# EAGLE design dualPilot (EAGLE 9.3.1)
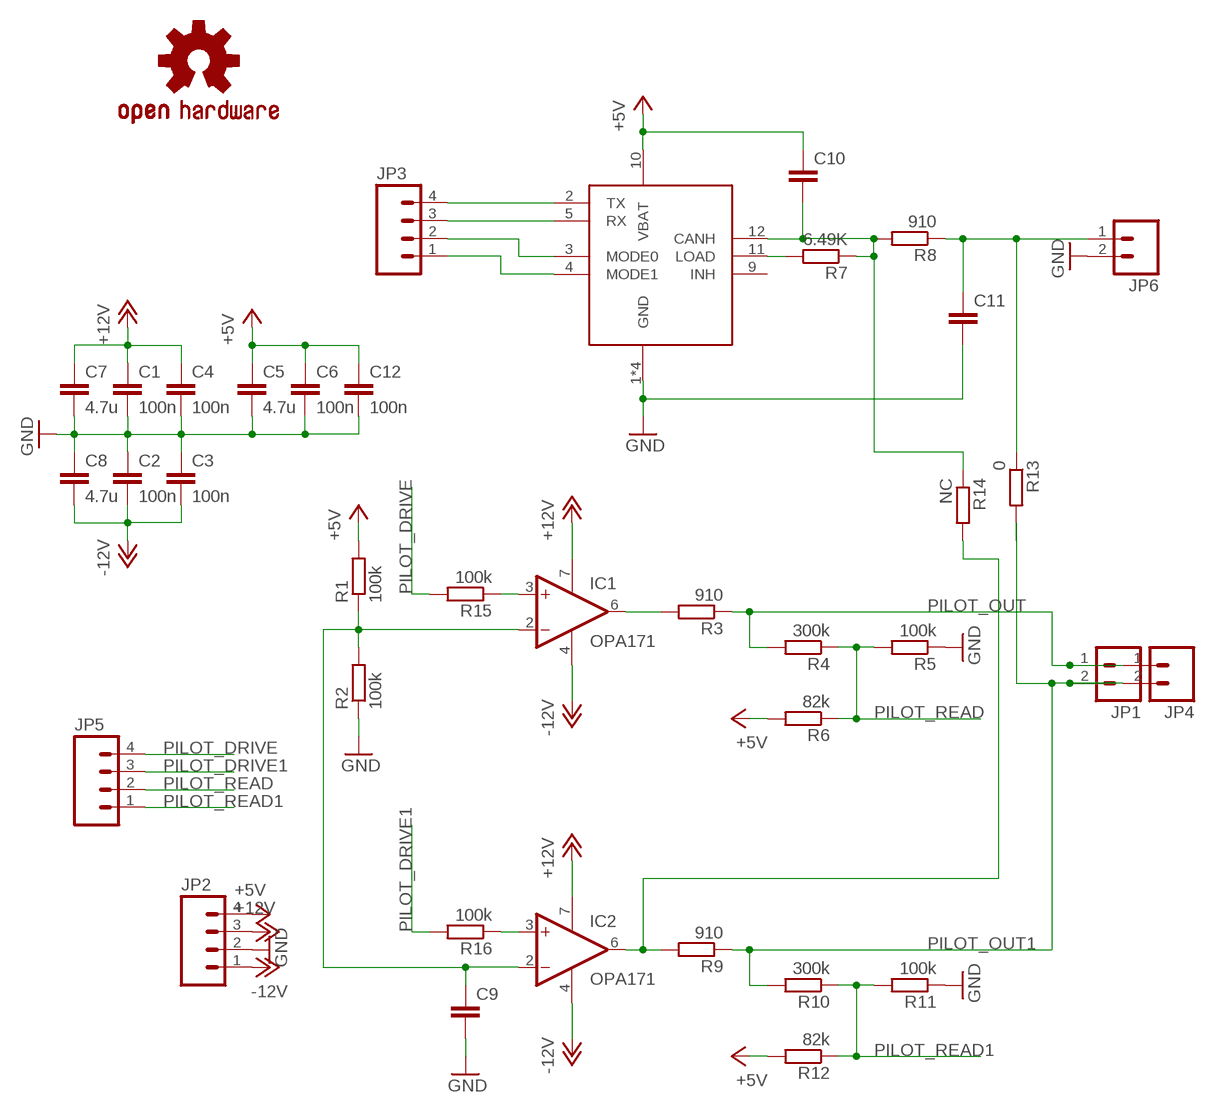
[diagram p0: schematic, sheet 1]

## Parts
C1  100n  CAP0805  [0805]
C2  100n  CAP0805  [0805]
C3  100n  CAP0805  [0805]
C4  100n  CAP0805  [0805]
C5  4.7u  CAP0805  [0805]
C6  100n  CAP0805  [0805]
C7  4.7u  CAP0805  [0805]
C8  4.7u  CAP0805  [0805]
C9  CAP0805  [0805]
C10  CAP0805  [0805]
C11  CAP0805  [0805]
C12  100n  CAP0805  [0805]
IC1  OPA171  OPA344U  [SO08]
IC2  OPA171  OPA344U  [SO08]
JP1  M02LOCK_LONGPADS  [1X02_LOCK_LONGPADS]
JP2  M04LONGPADS  [1X04_LONGPADS]
JP3  M04LONGPADS  [1X04_LONGPADS]
JP4  M025MM  [SCREWTERMINAL-5MM-2]
JP5  M04LONGPADS  [1X04_LONGPADS]
JP6  M02LOCK_LONGPADS  [1X02_LOCK_LONGPADS]
R1  100k  R-EU_R0805  [R0805]
R2  100k  R-EU_R0805  [R0805]
R3  910  R-EU_R1206  [R1206]
R4  300k  R-EU_R0805  [R0805]
R5  100k  R-EU_R0805  [R0805]
R6  82k  R-EU_R0805  [R0805]
R7  6.49K  R-EU_R0805  [R0805]
R8  910  R-EU_R1206  [R1206]
R9  910  R-EU_R1206  [R1206]
R10  300k  R-EU_R0805  [R0805]
R11  100k  R-EU_R0805  [R0805]
R12  82k  R-EU_R0805  [R0805]
R13  0  R-EU_R0805  [R0805]
R14  NC  R-EU_R0805  [R0805]
R15  100k  R-EU_R0805  [R0805]
R16  100k  R-EU_R0805  [R0805]
U$1  NCV7356  [SO14]
U$2  OSHW-LOGOS  [OSHW-LOGO-S]

## Nets
+5V: C5.1 C6.1 C10.1 C12.1 JP2.4 R1.2 R6.2 R12.2 U$1.10(VBAT)
+12V: C1.1 C4.1 C7.1 IC1.7(V+) IC2.7(V+) JP2.3
-12V: C2.2 C3.2 C8.2 IC1.4(V-) IC2.4(V-) JP2.1
GND: C1.2 C2.1 C3.1 C4.2 C5.2 C6.2 C7.2 C8.1 C9.2 C11.2 C12.2 JP2.2 JP6.2 R2.1 R5.1 R11.1 U$1.1(GND) U$1.7(GND) U$1.8(GND) U$1.14(GND)
N$1: C9.1 IC1.2(-IN) IC2.2(-IN) R1.1 R2.2
N$2: JP3.3 U$1.5(RX)
N$3: IC1.6(OUT) R3.2
N$4: C11.1 JP6.1 R8.1 R13.1
N$5: IC2.3(+IN) R16.1
N$6: R7.2 U$1.11(LOAD)
N$7: JP3.2 U$1.3(MODE0)
N$8: C10.2 R7.1 R8.2 R14.1 U$1.12(CANH)
N$9: JP3.1 U$1.4(MODE1)
N$10: IC2.6(OUT) R9.2 R14.2
N$11: IC1.3(+IN) R15.1
N$12: JP3.4 U$1.2(TX)
PILOT_DRIVE: JP5.4 R15.2
PILOT_DRIVE1: JP5.3 R16.2
PILOT_OUT: JP1.1 JP4.1 R3.1 R4.2
PILOT_OUT1: JP1.2 JP4.2 R9.1 R10.2 R13.2
PILOT_READ: JP5.2 R4.1 R5.2 R6.1
PILOT_READ1: JP5.1 R10.1 R11.2 R12.1
Unconnected: U$1.9(INH)

## Library data of the parts
C1-C12 = SparkFun:CAP: Capacitor Standard 0603 ceramic capacitor, and 0.1" leaded capacitor.
IC1 IC2 = linear:OPA*: Single Operational Amplifier Low Power, Single-Supply, Rail-To-Rail Operational Amplifier Source: http://focus.ti.com/lit/ds/symlink/opa2345.pdf
JP1 JP6 = SparkFun:M02: Header 2 Standard 2-pin 0.1" header. Use with straight break away headers (SKU : PRT-00116), right angle break away headers (PRT-00553), swiss pins (PRT-00743), machine pins (PRT-00117), and female headers (PRT-00115). Molex polarized connector foot print use with SKU : PRT-08233 with associated crimp pins and housings.
JP2 = SparkFun:M04: Header 4 Standard 4-pin 0.1" header. Use with straight break away headers (SKU : PRT-00116), right angle break away headers (PRT-00553), swiss pins (PRT-00743), machine pins (PRT-00117), and female headers (PRT-00115). Molex polarized connector foot print use with SKU : PRT-08231 with associated crimp pins and housings. 1MM SMD Version SKU: PRT-10208
JP3 JP5 = SparkFun-Connectors:M04: Header 4 Standard 4-pin 0.1" header. Use with straight break away headers (SKU : PRT-00116), right angle break away headers (PRT-00553), swiss pins (PRT-00743), machine pins (PRT-00117), and female headers (PRT-00115). Molex polarized connector foot print use with SKU : PRT-08231 with associated crimp pins and housings. 1MM SMD Version SKU: PRT-10208
JP4 = SparkFun-Connectors:M02: Standard 2-pin 0.1" header. Use with - straight break away headers ( PRT-00116) - right angle break away headers (PRT-00553) - swiss pins (PRT-00743) - machine pins (PRT-00117) - female headers (PRT-00115) Molex polarized connector foot print use with: PRT-08233 with associated crimp pins and housings. 2.54_SCREWTERM for use with PRT-10571. 3.5mm Screw Terminal footprints for PRT-08084 5mm Screw Terminal footprints for use with PRT-08432; STOREFRONT_ID: PRT-08432
R1-R16 = resistor:R-EU_: RESISTOR, European symbol; SPICEPREFIX: R
U$1 = evse:NCV7356
U$2 = SparkFun:OSHW-LOGO: Open Source Hardware Logo This logo indicates the piece of hardware it is found on incorporates a OSHW license and/or adheres to the definition of open source hardware found here: http://freedomdefined.org/OSHW

## Board
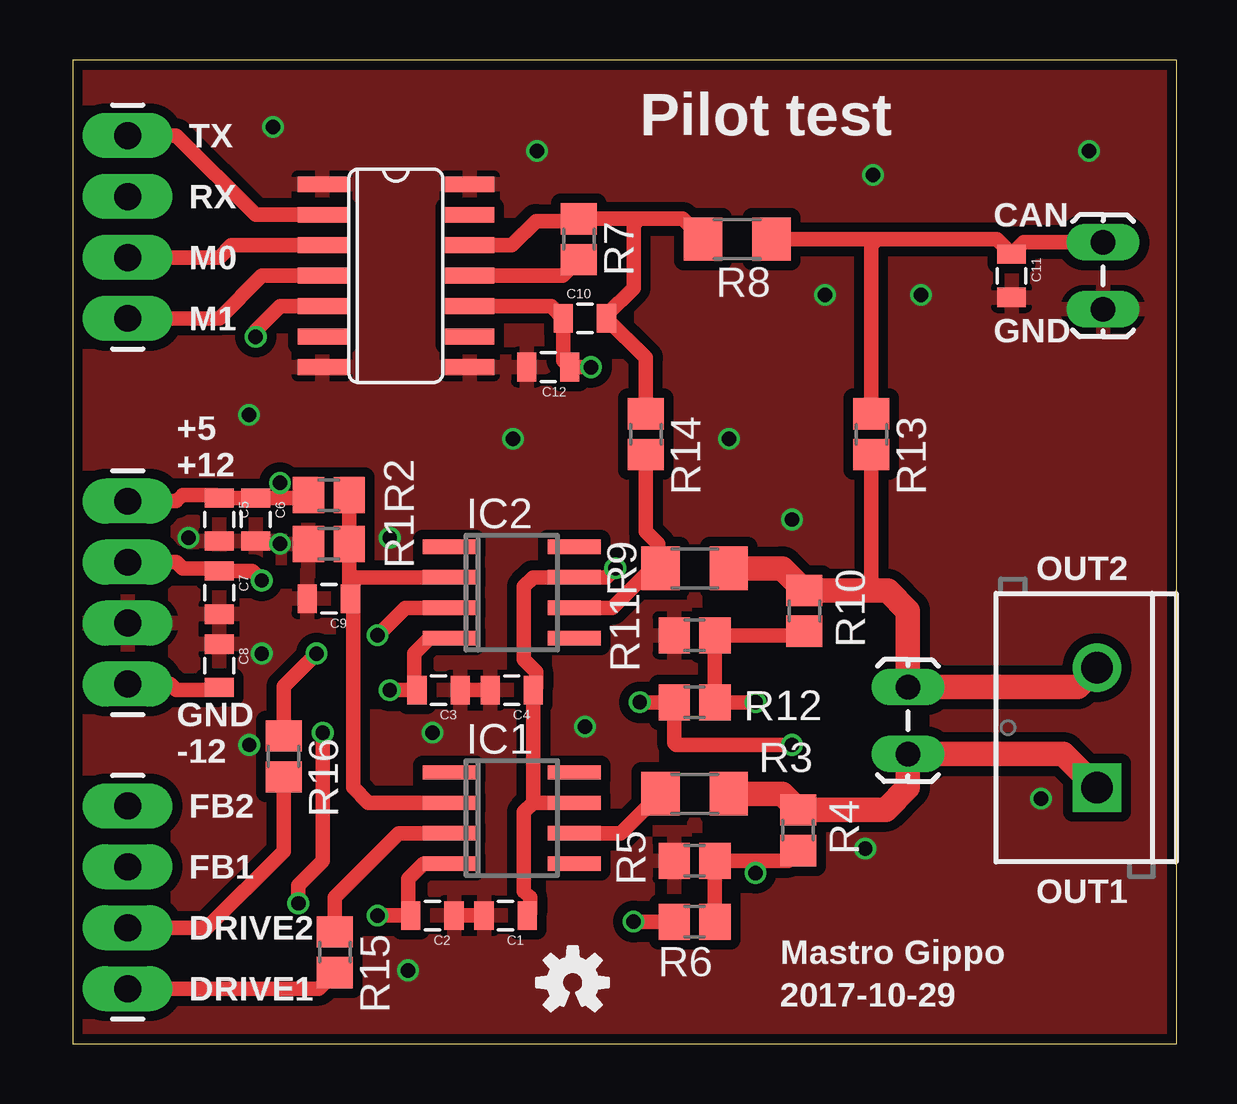
[diagram p1: board, top side]
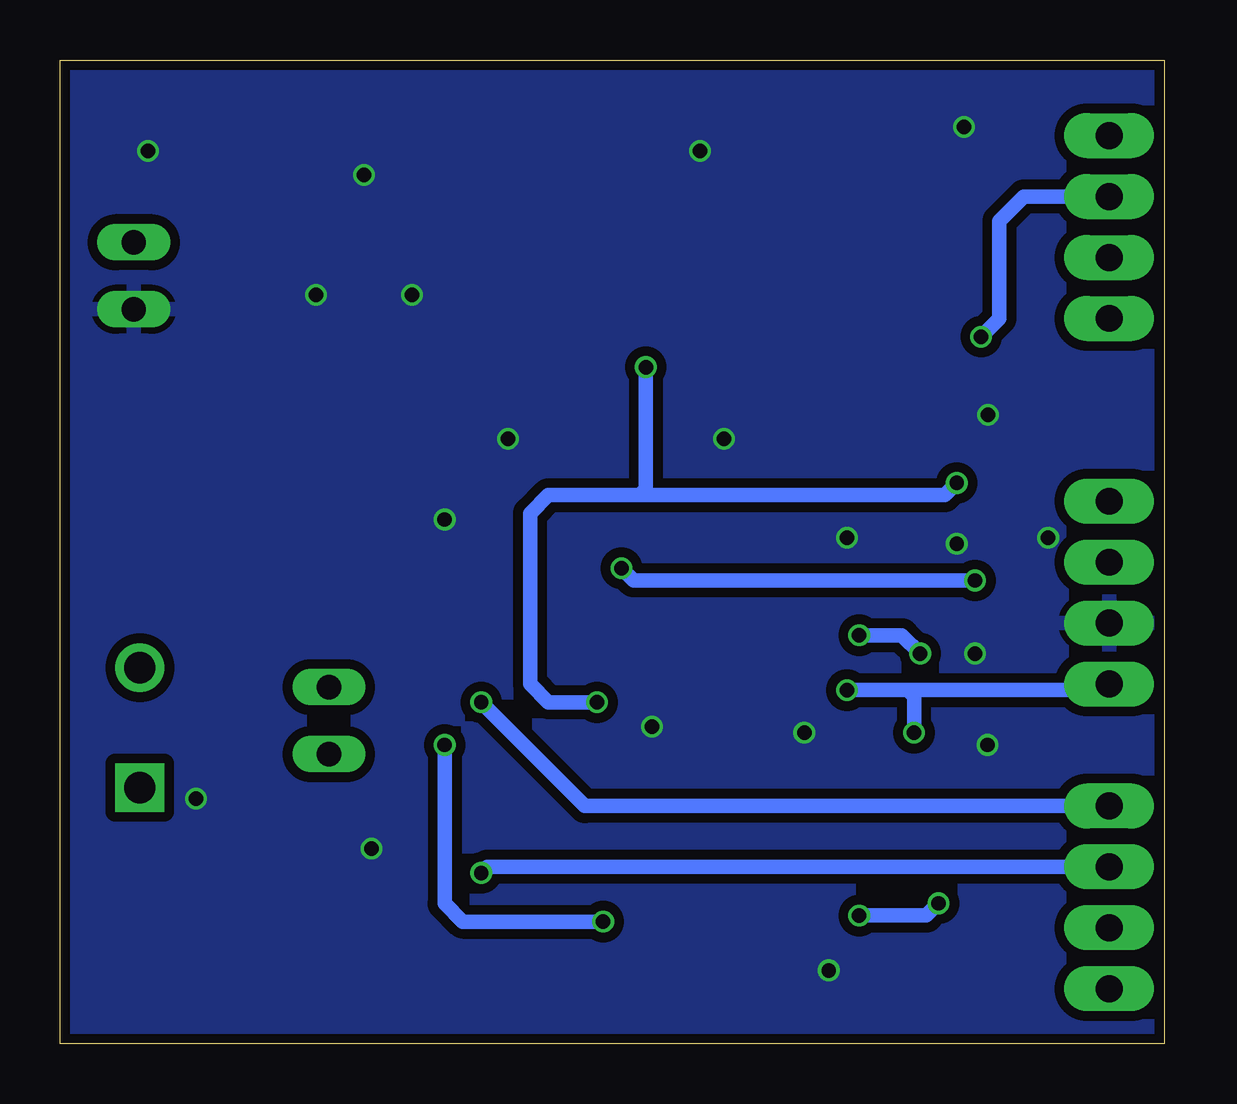
[diagram p2: board, bottom side, seen from below]

Size 46 x 41 mm. Coordinates in mm from the lower left corner, seen from the top.
Outline: 0,0 46,0 46,41 0,41 0,0
Copper layers (1*16): Top 0.035mm / dielectric 1.5mm / Bottom 0.035mm
Design rules "ITEADstudio_DRC": minimum track width 6mil, minimum drill 12mil, track to track 6mil, track to pad 6mil, pad to pad 6mil, via to via 6mil, smd to smd 0mil, copper to edge 10mil, drill to drill 10mil, minimum pad ring 10mil, minimum via ring 6mil, stop-mask expansion 2mil, vias tented up to drill 100mil, thermal gap 10mil

### Footprints (pad centres in the part's own frame; a part is rotated, then mirrored left to right if it is on the bottom)
0805 = smd 0.8 x 1.2: 1 -0.9,0; 2 0.9,0
SO08 = smd 0.6 x 2.2: 1 -1.905,-2.6; 2 -0.635,-2.6; 3 0.635,-2.6; 4 1.905,-2.6; 5 1.905,2.6; 6 0.635,2.6; 7 -0.635,2.6; 8 -1.905,2.6
1X02_LOCK_LONGPADS = drill 1.016 long: 1 -0.127,0; 2 2.667,0
1X04_LONGPADS = drill 1.118 pad 1.88 long: 1 0,0; 2 2.54,0; 3 5.08,0; 4 7.62,0
SCREWTERMINAL-5MM-2 = drill 1.3 pad 2.032 square: 1 0,0 | drill 1.3 pad 2.032: 2 5,0
R0805 = smd 1.3 x 1.5: 1 -0.85,0; 2 0.85,0
R1206 = smd 1.6 x 1.803: 1 -1.422,0; 2 1.422,0
SO14 = smd 0.66 x 2.032: 1 -3.81,-3.073; 2 -2.54,-3.073; 3 -1.27,-3.073; 4 0,-3.073; 5 1.27,-3.073; 6 2.54,-3.073; 7 3.81,-3.073; 8 3.81,3.073; 9 2.54,3.073; 10 1.27,3.073; 11 0,3.073; 12 -1.27,3.073; 13 -2.54,3.073; 14 -3.81,3.073

### Placement (x,y rotation side)
C1  18.03,5.33 180 top
C2  14.99,5.33 180 top
C3  15.24,14.73 180 top
C4  18.29,14.73 180 top
C5  6.1,21.84 270 top
C6  7.62,21.84 270 top
C7  6.1,18.8 270 top
C8  6.1,15.75 270 top
C9  10.67,18.54 180 top
C10  21.34,30.23 0 top
C11  39.12,32 270 top
C12  19.81,28.19 180 top
IC1  18.29,9.4 270 top
IC2  18.29,18.8 270 top
JP1  34.8,12.19 90 top
JP2  2.29,14.99 90 top
JP3  2.29,30.23 90 top
JP4  42.67,10.67 90 top
JP5  2.29,9.91 270 top
JP6  42.93,33.27 270 top
R1  10.67,22.86 180 top
R2  10.67,20.83 0 top
R3  25.91,10.41 180 top
R4  30.23,8.89 90 top
R5  25.91,7.62 0 top
R6  25.91,5.08 180 top
R7  21.08,33.53 270 top
R8  27.69,33.53 180 top
R9  25.91,19.81 180 top
R10  30.48,18.03 90 top
R11  25.91,17.02 0 top
R12  25.91,14.22 180 top
R13  33.27,25.4 270 top
R14  23.88,25.4 270 top
R15  10.92,3.81 270 top
R16  8.78,11.97 270 top
U$1  13.46,32 270 top
U$2  20.83,2.54 0 top

### Tracks (layer width: path | path; a pad name or v marks a point on that pad's centre or on a via)
+5V  (via drill 0.6)
  Top 0.61: JP2.4 4.32,22.61 4.57,22.86 5.98,22.86 C5.1 C6.1 8.64,22.74 | 8.64,22.74 9.7,22.74 R1.2 | v29.97,12.45 25.15,12.45 25.06,12.53 R12.2 v23.62,14.22 | v23.37,5.08 R6.2 | v8.64,23.37 8.64,22.74 | U$1.10 19.93,30.73 C10.1 20.44,28.47 C12.1 v21.59,28.19
  Bottom 0.61: v29.97,12.45 29.97,5.84 29.21,5.08 v23.37,5.08 | v23.62,14.22 25.65,14.22 26.42,14.99 26.42,22.1 25.65,22.86 21.84,22.86 | 21.84,22.86 9.14,22.86 v8.64,23.37 | v21.59,28.19 21.59,23.11 21.84,22.86
+12V  (via drill 0.6)
  Top 0.61: IC1.7 19.3,10.03 | 19.3,10.03 19.18,10.03 18.8,9.65 18.8,6.35 19.05,6.1 19.05,5.45 C1.1 | 19.3,10.03 19.19,10.15 C4.1 19.3,14.85 19.3,15.49 18.8,16 18.8,19.05 19.18,19.43 IC2.7 22.23,19.43 v22.61,19.81 22.35,19.56 | JP2.3 4.32,20.07 4.57,19.81 5.98,19.81 C7.1 7.48,19.7 v7.87,19.3
  Bottom 0.61: v7.87,19.3 22.1,19.3 v22.61,19.81
-12V  (via drill 0.6)
  Top 0.61: IC1.4 14.61,7.49 13.97,6.86 13.97,5.45 C2.2 v12.7,5.33 | IC2.4 14.86,16.89 14.22,16.26 14.22,14.85 C3.2 v13.21,14.73 | JP2.1 4.06,14.99 4.32,14.73 5.98,14.73 C8.2 | v9.4,5.84 9.4,6.6 10.41,7.62 v10.41,12.95
  Bottom 0.61: v13.21,14.73 10.67,14.73 | 10.67,14.73 2.54,14.73 JP2.1 | v12.7,5.33 9.91,5.33 v9.4,5.84 | v10.41,12.95 10.41,14.48 10.67,14.73
GND  (via drill 0.6)
  Top 0.61: C1.2 C2.1 | C4.2 C3.1
  other vias: 7.35,12.45 14.99,12.95 21.34,13.21 13.21,21.08 7.87,16.26 13.97,3.05 33.02,8.13 29.97,21.84 8.64,20.83 4.83,21.08 18.34,25.21 7.34,26.21 8.34,38.21 19.34,37.21 42.34,37.21 33.34,36.21 35.34,31.21 31.34,31.21 27.34,25.21 40.34,10.21
  pour Top (isolate 0.406): 0.51,40.64 46.23,40.64 45.97,0.25 0.25,0.25
  pour Bottom (isolate 0.406): 0.51,40.64 46.23,40.64 45.97,0.25 0.25,0.25
N$1
  Top 0.61: R1.1 R2.2 11.52,19.05 | 11.52,19.05 11.52,18.59 C9.1 11.68,18.43 11.68,10.67 12.32,10.03 IC1.2 | IC2.2 11.9,19.43 11.52,19.05
N$2  (via drill 0.6)
  Top 0.61: v7.62,29.46 7.62,29.72 8.64,30.73 U$1.5
  Bottom 0.61: JP3.3 5.84,35.31 6.86,34.29 6.86,30.23 v7.62,29.46
N$3
  Top 0.61: IC1.6 22.84,8.76 R3.2
N$4
  Top 0.61: R8.1 33.53,33.53 | 33.53,33.53 38.49,33.53 C11.1 39.61,33.4 JP6.1 | R13.1 33.27,33.27 33.53,33.53
N$5  (via drill 0.6)
  Top 0.61: R16.1 8.78,14.88 v10.16,16.26 | v12.7,17.02 13.84,18.16 IC2.3
  Bottom 0.61: v10.16,16.26 10.92,17.02 v12.7,17.02
N$6
  Top 0.61: U$1.11 20.41,32 R7.2
N$7
  Top 0.61: U$1.3 6.6,33.27 6.1,32.77 JP3.2
N$8
  Top 0.61: U$1.12 18.29,33.27 19.3,34.29 20.99,34.29 R7.1 23.62,34.38 | 23.62,34.38 25.41,34.38 R8.2 | 23.62,34.38 23.37,34.12 23.37,31.5 22.24,30.36 C10.2 23.88,28.59 R14.1
N$9
  Top 0.61: U$1.4 7.87,32 6.1,30.23 JP3.1
N$10
  Top 0.61: IC2.6 22.48,18.16 23.88,19.56 24.23,19.56 R9.2 24.38,19.91 24.38,20.83 23.88,21.34 R14.2
N$11
  Top 0.61: R15.1 10.92,6.1 13.59,8.76 IC1.3
N$12
  Top 0.61: JP3.4 4.32,37.85 7.62,34.54 U$1.2
PILOT_DRIVE
  Top 0.61: R15.2 10.25,2.29 JP5.4
PILOT_DRIVE1
  Top 0.61: JP5.3 5.59,4.83 8.78,8.02 R16.2
PILOT_OUT
  Top 1.016: R3.1 29.55,10.41 R4.2 33.87,9.74 34.8,10.67 JP1.1 41.27,12.06 JP4.1
PILOT_OUT1
  Top 0.61: R13.2 33.27,19.14 33.02,18.88
  Top 1.016: R9.1 29.55,19.81 R10.2 33.02,18.88 33.95,18.88 34.8,18.03 JP1.2 41.86,14.86 JP4.2
PILOT_READ  (via drill 0.6)
  Top 0.61: R6.1 R5.2 28.45,7.62 | 28.45,7.62 29.81,7.62 R4.1 | v28.45,7.11 28.45,7.62
  Bottom 0.61: JP5.2 28.19,7.37 v28.45,7.11
PILOT_READ1  (via drill 0.6)
  Top 0.61: R10.1 30.31,17.02 R11.2 R12.1 v28.45,14.22
  Bottom 0.61: JP5.1 24.13,9.91 v28.45,14.22

### Text on the board
tNames: Pilot test | TX | RX | CAN | M0 | M1 | GND | +5 / +12 | OUT2 | GND / -12 | FB2 | FB1 | OUT1 | DRIVE2 | Mastro Gippo | DRIVE1 | 2017-10-29